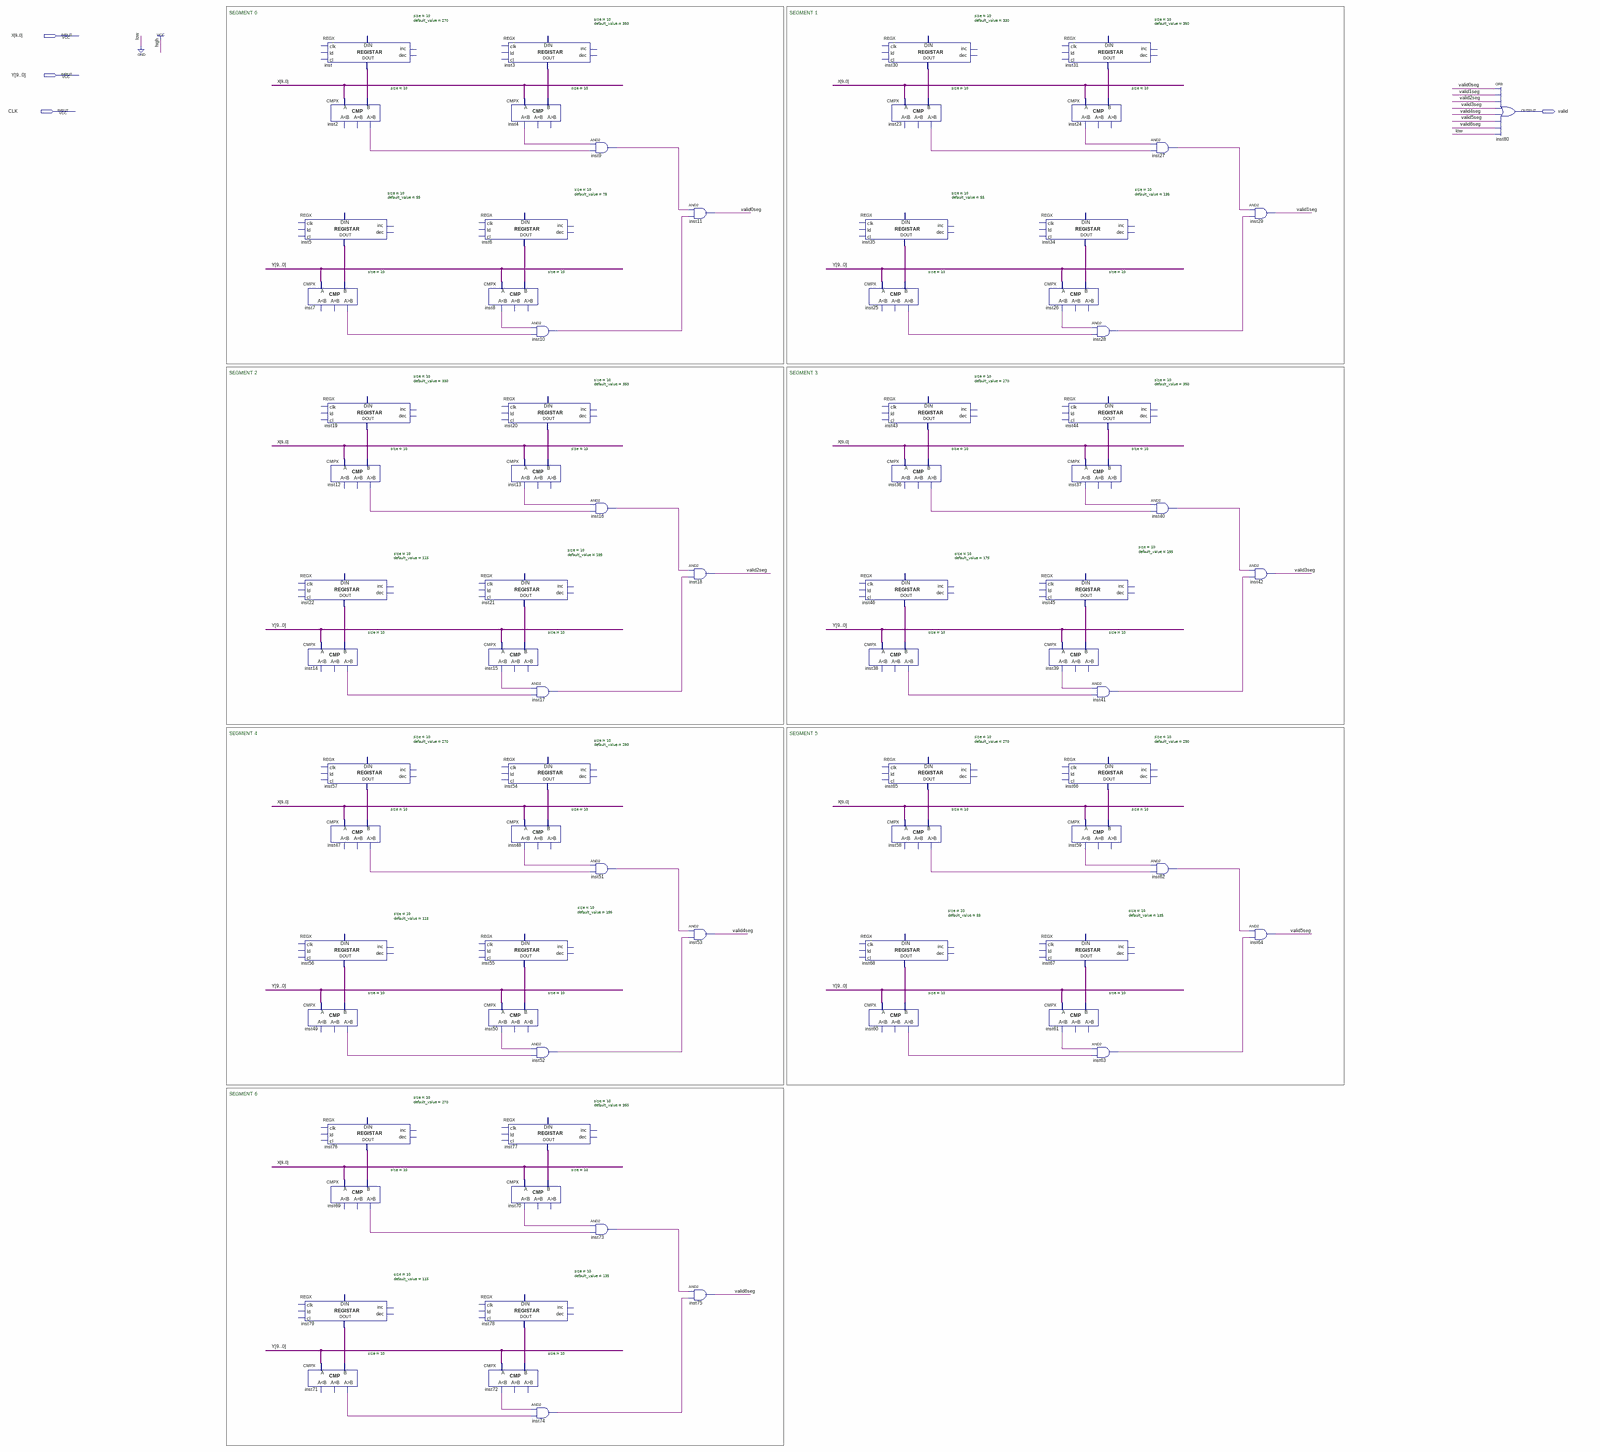
[diagram p0: schematic sheet, whole]
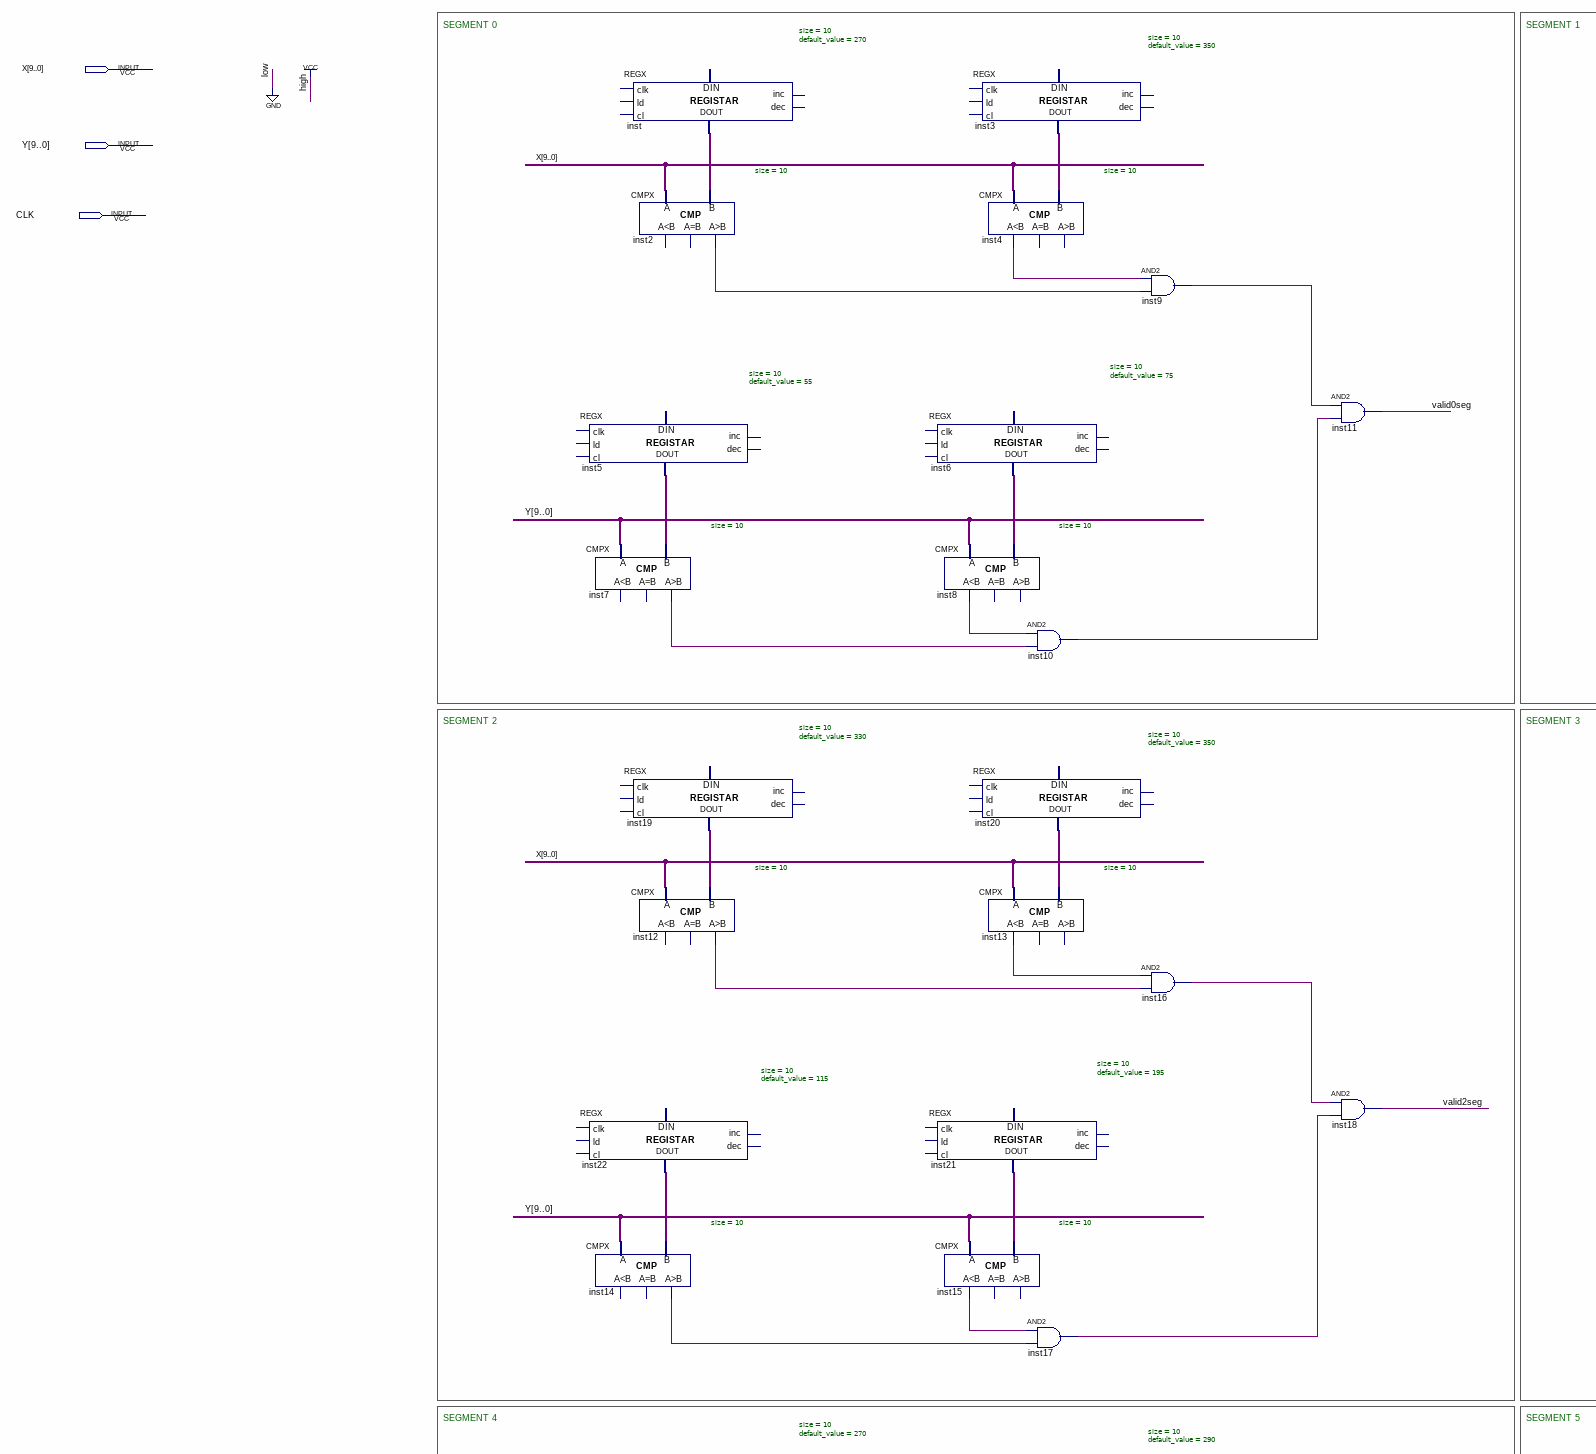
[diagram p1: schematic sheet, upper left part]
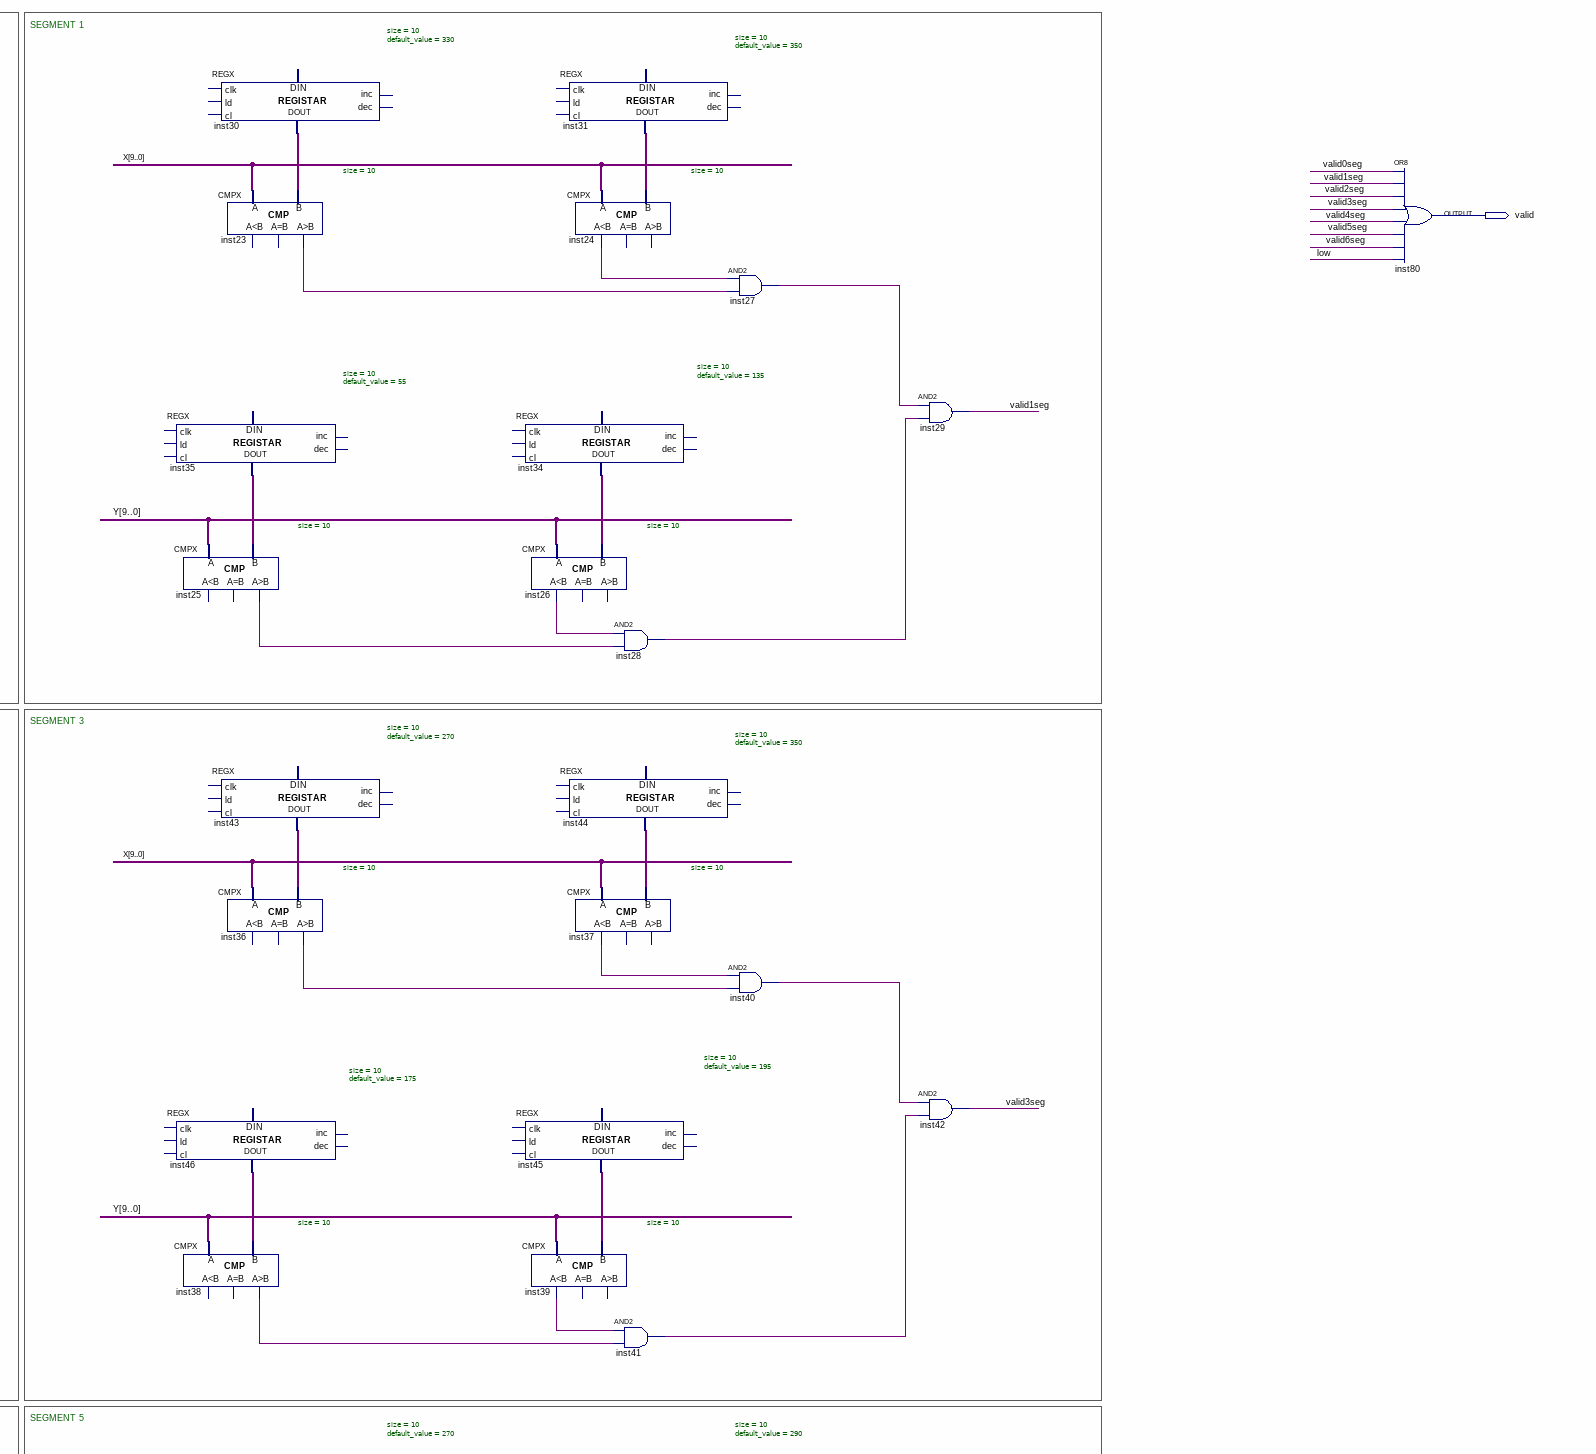
[diagram p2: schematic sheet, upper right part]
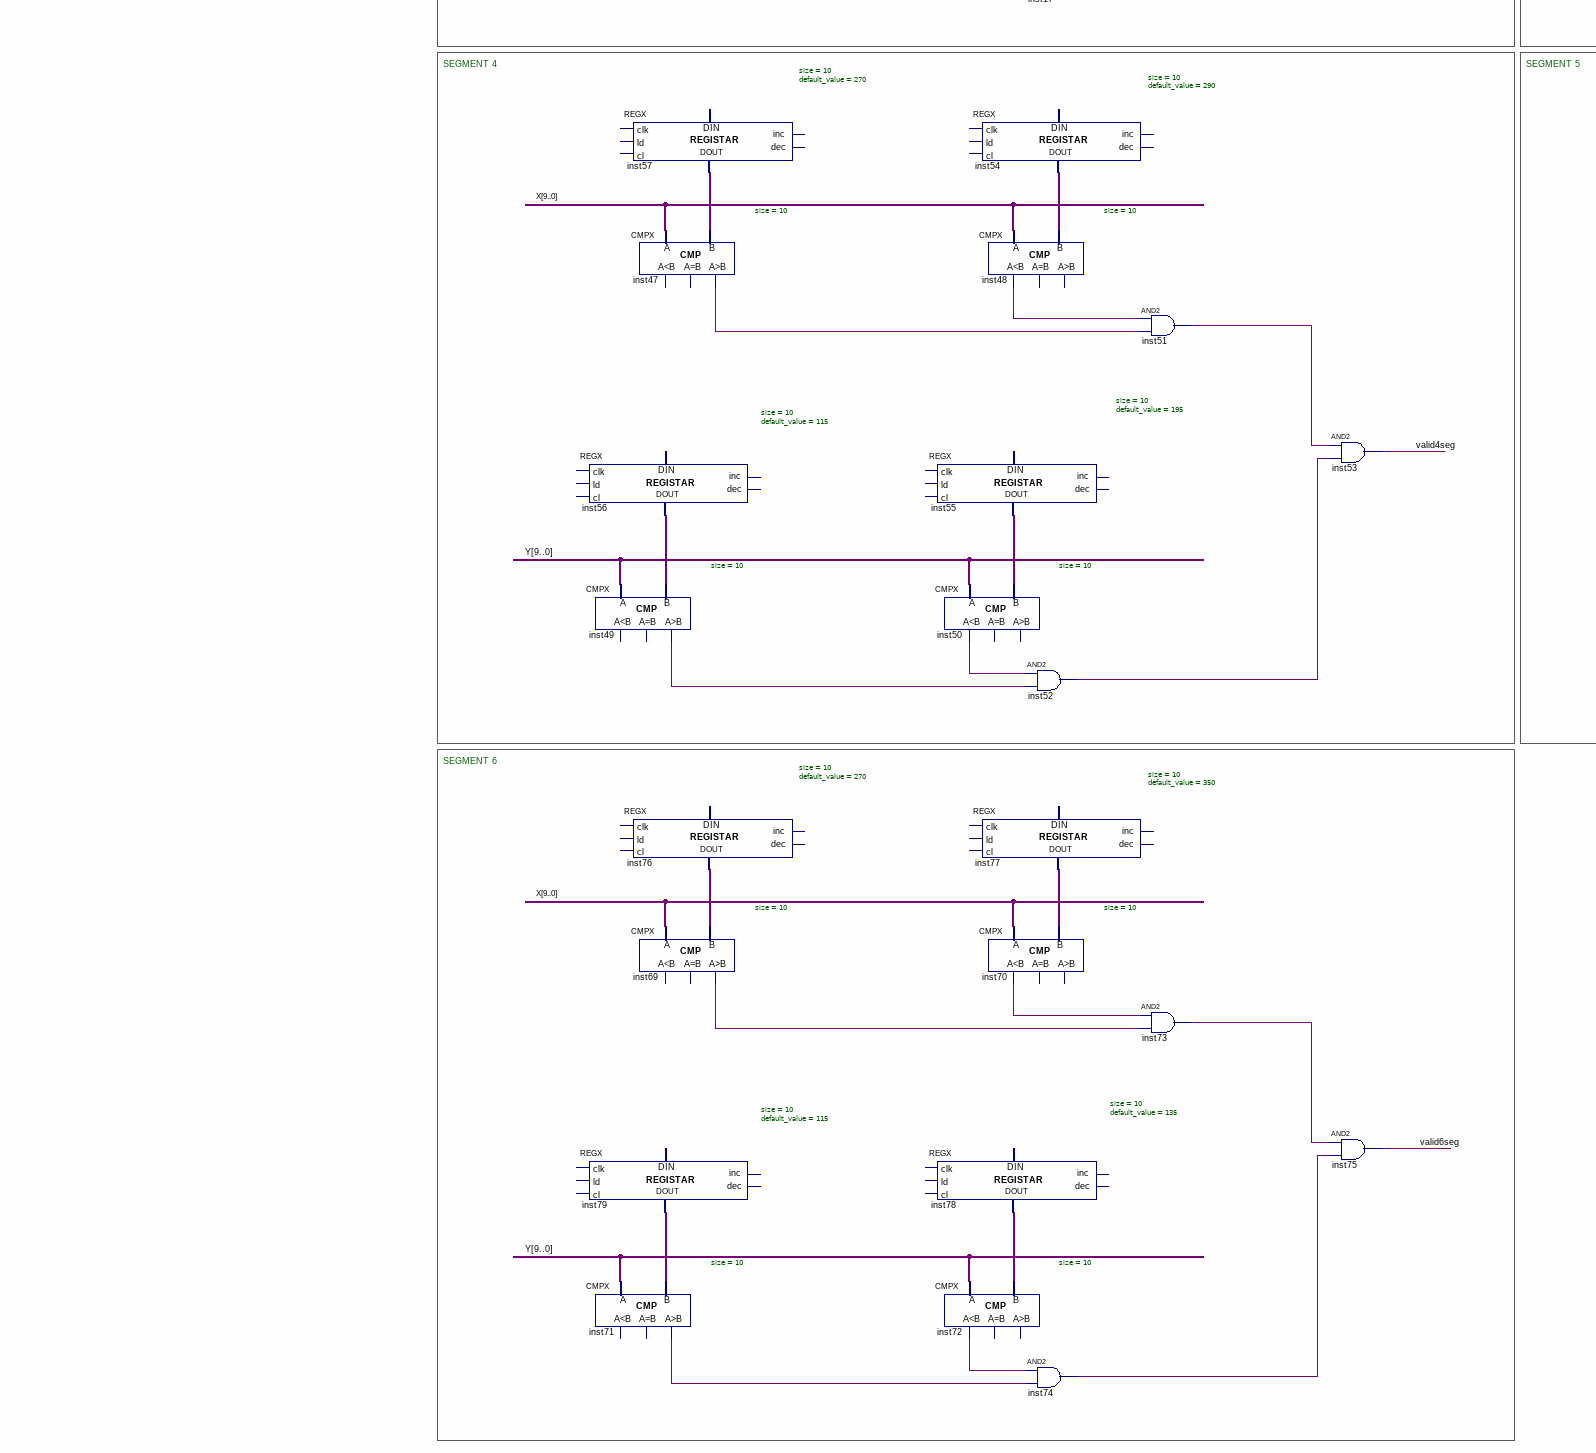
[diagram p3: schematic sheet, lower left part]
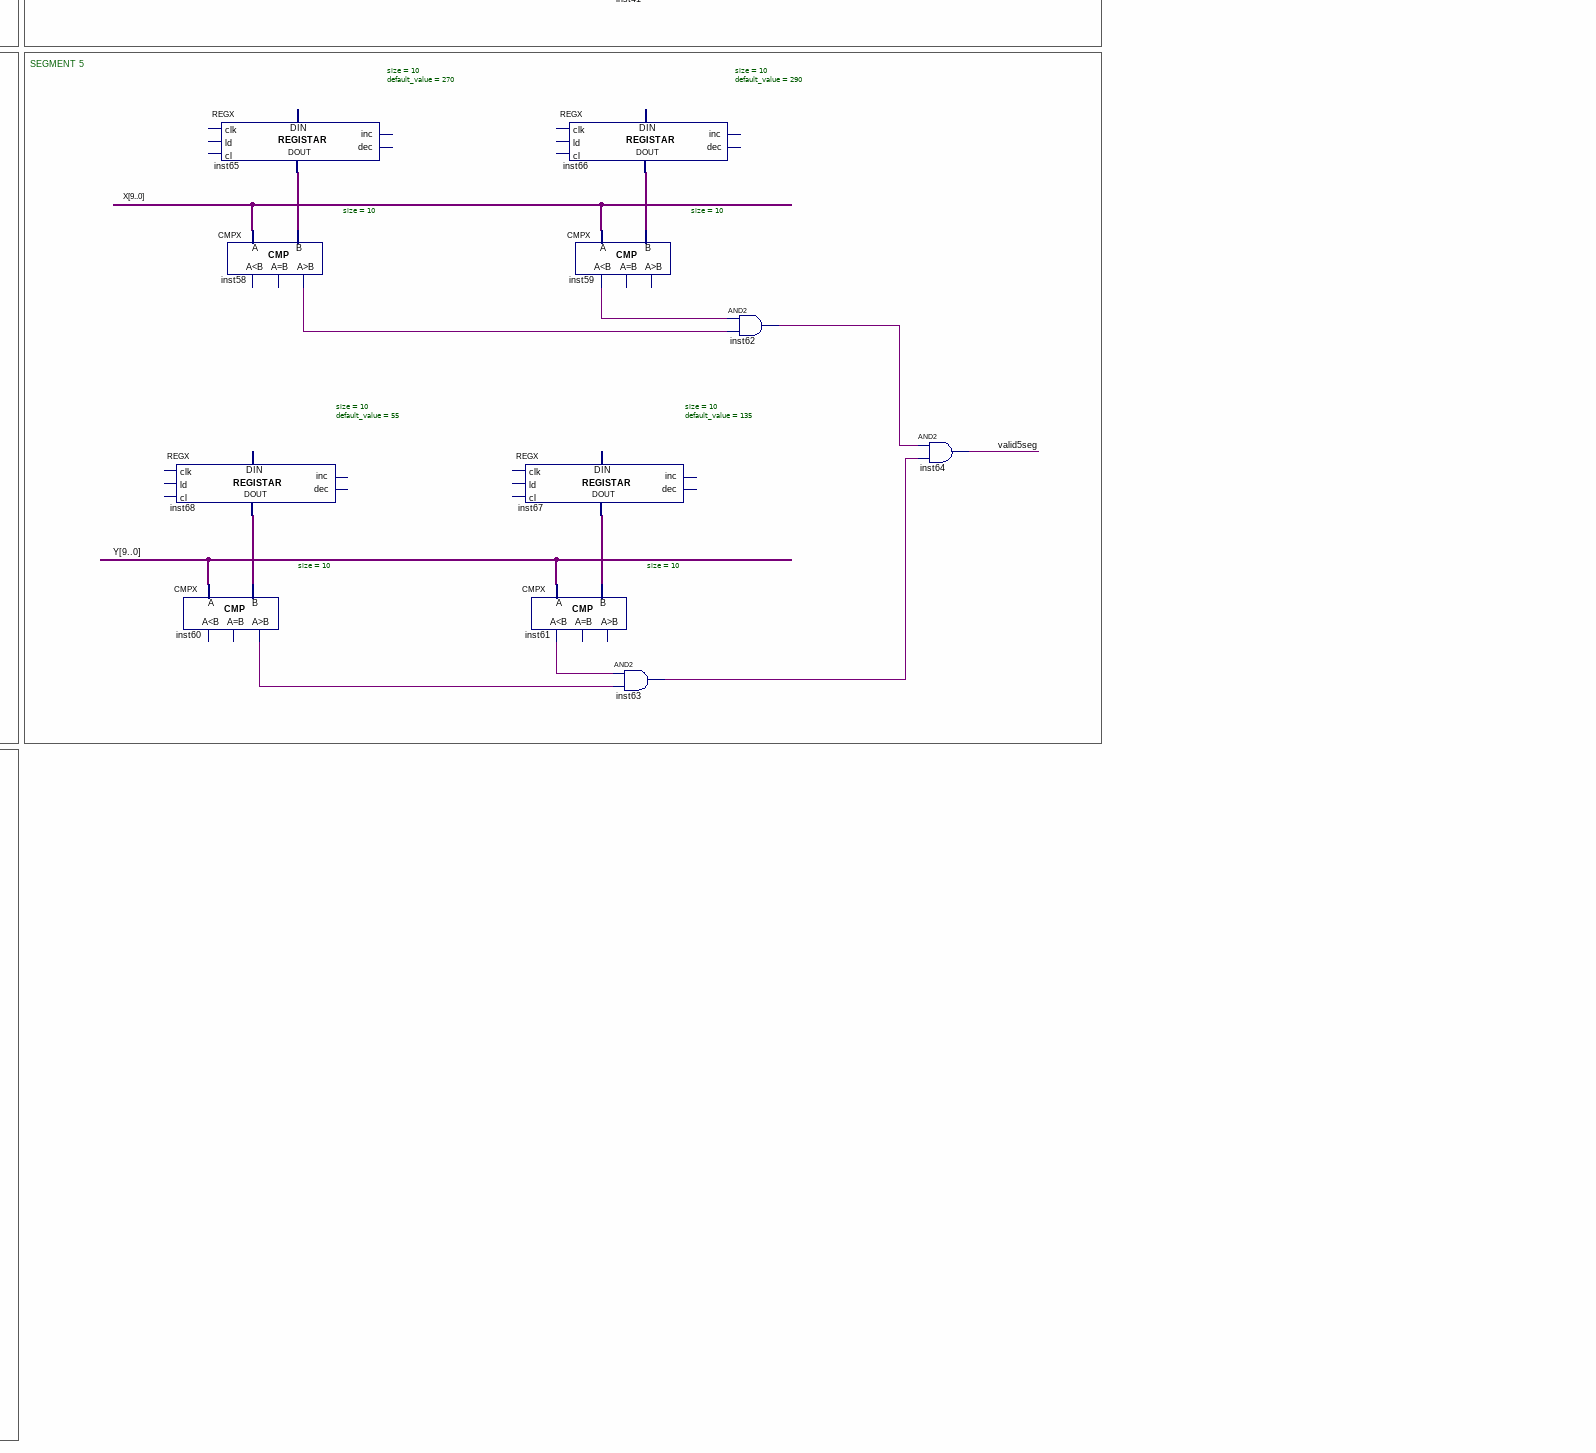
[diagram p4: schematic sheet, lower right part]
// Quartus schematic 7segments.bdf as structural Verilog: 78 symbols, 4 pins
module \7segments  (
  input  [9:0] X,
  input  [9:0] Y,
  input  CLK,
  output valid
);

  wire inst2_gr, inst4_ls, inst7_gr, inst8_ls, inst9_out, inst10_out, inst12_gr, inst13_ls, inst14_gr,
       inst15_ls, inst16_out, inst17_out, inst23_gr, inst24_ls, inst25_gr, inst26_ls, inst27_out, inst28_out,
       inst36_gr, inst37_ls, inst38_gr, inst39_ls, inst40_out, inst41_out, inst47_gr, inst48_ls, inst49_gr,
       inst50_ls, inst51_out, inst52_out, inst58_gr, inst59_ls, inst60_gr, inst61_ls, inst62_out, inst63_out,
       inst69_gr, inst70_ls, inst71_gr, inst72_ls, inst73_out, inst74_out, valid0seg, valid1seg, valid2seg,
       valid3seg, valid4seg, valid5seg, valid6seg;
  wire [9:0] inst3_data_out, inst5_data_out, inst6_data_out, inst19_data_out, inst20_data_out,
       inst21_data_out, inst22_data_out, inst30_data_out, inst31_data_out, inst34_data_out, inst35_data_out,
       inst43_data_out, inst44_data_out, inst45_data_out, inst46_data_out, inst54_data_out, inst55_data_out,
       inst56_data_out, inst57_data_out, inst65_data_out, inst66_data_out, inst67_data_out, inst68_data_out,
       inst76_data_out, inst77_data_out, inst78_data_out, inst79_data_out, inst_data_out;

  REGX #(.size(10), .default_value(270)) inst (.data_out(inst_data_out));  // open: clk, ld, cl, inc, dec, data_in
  REGX #(.size(10), .default_value(55)) inst5 (.data_out(inst5_data_out));  // open: clk, ld, cl, inc, dec, data_in
  CMPX #(.size(10)) inst7 (.A(Y), .B(inst5_data_out), .gr(inst7_gr));  // open: ls, eq
  REGX #(.size(10), .default_value(330)) inst19 (.data_out(inst19_data_out));  // open: clk, ld, cl, inc, dec, data_in
  REGX #(.size(10), .default_value(115)) inst22 (.data_out(inst22_data_out));  // open: clk, ld, cl, inc, dec, data_in
  CMPX #(.size(10)) inst14 (.A(Y), .B(inst22_data_out), .gr(inst14_gr));  // open: ls, eq
  REGX #(.size(10), .default_value(270)) inst57 (.data_out(inst57_data_out));  // open: clk, ld, cl, inc, dec, data_in
  REGX #(.size(10), .default_value(115)) inst56 (.data_out(inst56_data_out));  // open: clk, ld, cl, inc, dec, data_in
  CMPX #(.size(10)) inst49 (.A(Y), .B(inst56_data_out), .gr(inst49_gr));  // open: ls, eq
  REGX #(.size(10), .default_value(270)) inst76 (.data_out(inst76_data_out));  // open: clk, ld, cl, inc, dec, data_in
  REGX #(.size(10), .default_value(115)) inst79 (.data_out(inst79_data_out));  // open: clk, ld, cl, inc, dec, data_in
  CMPX #(.size(10)) inst71 (.A(Y), .B(inst79_data_out), .gr(inst71_gr));  // open: ls, eq
  CMPX #(.size(10)) inst2 (.A(X), .B(inst_data_out), .gr(inst2_gr));  // open: ls, eq
  CMPX #(.size(10)) inst12 (.A(X), .B(inst19_data_out), .gr(inst12_gr));  // open: ls, eq
  CMPX #(.size(10)) inst47 (.A(X), .B(inst57_data_out), .gr(inst47_gr));  // open: ls, eq
  CMPX #(.size(10)) inst69 (.A(X), .B(inst76_data_out), .gr(inst69_gr));  // open: ls, eq
  REGX #(.size(10), .default_value(75)) inst6 (.data_out(inst6_data_out));  // open: clk, ld, cl, inc, dec, data_in
  REGX #(.size(10), .default_value(195)) inst21 (.data_out(inst21_data_out));  // open: clk, ld, cl, inc, dec, data_in
  REGX #(.size(10), .default_value(195)) inst55 (.data_out(inst55_data_out));  // open: clk, ld, cl, inc, dec, data_in
  REGX #(.size(10), .default_value(135)) inst78 (.data_out(inst78_data_out));  // open: clk, ld, cl, inc, dec, data_in
  REGX #(.size(10), .default_value(350)) inst3 (.data_out(inst3_data_out));  // open: clk, ld, cl, inc, dec, data_in
  CMPX #(.size(10)) inst4 (.A(X), .B(inst3_data_out), .ls(inst4_ls));  // open: eq, gr
  CMPX #(.size(10)) inst8 (.A(Y), .B(inst6_data_out), .ls(inst8_ls));  // open: eq, gr
  REGX #(.size(10), .default_value(350)) inst20 (.data_out(inst20_data_out));  // open: clk, ld, cl, inc, dec, data_in
  CMPX #(.size(10)) inst13 (.A(X), .B(inst20_data_out), .ls(inst13_ls));  // open: eq, gr
  CMPX #(.size(10)) inst15 (.A(Y), .B(inst21_data_out), .ls(inst15_ls));  // open: eq, gr
  REGX #(.size(10), .default_value(290)) inst54 (.data_out(inst54_data_out));  // open: clk, ld, cl, inc, dec, data_in
  CMPX #(.size(10)) inst48 (.A(X), .B(inst54_data_out), .ls(inst48_ls));  // open: eq, gr
  CMPX #(.size(10)) inst50 (.A(Y), .B(inst55_data_out), .ls(inst50_ls));  // open: eq, gr
  REGX #(.size(10), .default_value(350)) inst77 (.data_out(inst77_data_out));  // open: clk, ld, cl, inc, dec, data_in
  CMPX #(.size(10)) inst70 (.A(X), .B(inst77_data_out), .ls(inst70_ls));  // open: eq, gr
  CMPX #(.size(10)) inst72 (.A(Y), .B(inst78_data_out), .ls(inst72_ls));  // open: eq, gr
  and inst10 (inst10_out, inst8_ls, inst7_gr);
  and inst17 (inst17_out, inst15_ls, inst14_gr);
  and inst52 (inst52_out, inst50_ls, inst49_gr);
  and inst74 (inst74_out, inst72_ls, inst71_gr);
  and inst9 (inst9_out, inst4_ls, inst2_gr);
  and inst16 (inst16_out, inst13_ls, inst12_gr);
  and inst51 (inst51_out, inst48_ls, inst47_gr);
  and inst73 (inst73_out, inst70_ls, inst69_gr);
  and inst11 (valid0seg, inst9_out, inst10_out);
  and inst18 (valid2seg, inst16_out, inst17_out);
  and inst53 (valid4seg, inst51_out, inst52_out);
  and inst75 (valid6seg, inst73_out, inst74_out);
  REGX #(.size(10), .default_value(55)) inst35 (.data_out(inst35_data_out));  // open: clk, ld, cl, inc, dec, data_in
  CMPX #(.size(10)) inst25 (.A(Y), .B(inst35_data_out), .gr(inst25_gr));  // open: ls, eq
  REGX #(.size(10), .default_value(175)) inst46 (.data_out(inst46_data_out));  // open: clk, ld, cl, inc, dec, data_in
  CMPX #(.size(10)) inst38 (.A(Y), .B(inst46_data_out), .gr(inst38_gr));  // open: ls, eq
  REGX #(.size(10), .default_value(55)) inst68 (.data_out(inst68_data_out));  // open: clk, ld, cl, inc, dec, data_in
  CMPX #(.size(10)) inst60 (.A(Y), .B(inst68_data_out), .gr(inst60_gr));  // open: ls, eq
  REGX #(.size(10), .default_value(330)) inst30 (.data_out(inst30_data_out));  // open: clk, ld, cl, inc, dec, data_in
  CMPX #(.size(10)) inst23 (.A(X), .B(inst30_data_out), .gr(inst23_gr));  // open: ls, eq
  REGX #(.size(10), .default_value(270)) inst43 (.data_out(inst43_data_out));  // open: clk, ld, cl, inc, dec, data_in
  CMPX #(.size(10)) inst36 (.A(X), .B(inst43_data_out), .gr(inst36_gr));  // open: ls, eq
  REGX #(.size(10), .default_value(270)) inst65 (.data_out(inst65_data_out));  // open: clk, ld, cl, inc, dec, data_in
  CMPX #(.size(10)) inst58 (.A(X), .B(inst65_data_out), .gr(inst58_gr));  // open: ls, eq
  REGX #(.size(10), .default_value(135)) inst34 (.data_out(inst34_data_out));  // open: clk, ld, cl, inc, dec, data_in
  CMPX #(.size(10)) inst26 (.A(Y), .B(inst34_data_out), .ls(inst26_ls));  // open: eq, gr
  REGX #(.size(10), .default_value(195)) inst45 (.data_out(inst45_data_out));  // open: clk, ld, cl, inc, dec, data_in
  CMPX #(.size(10)) inst39 (.A(Y), .B(inst45_data_out), .ls(inst39_ls));  // open: eq, gr
  REGX #(.size(10), .default_value(135)) inst67 (.data_out(inst67_data_out));  // open: clk, ld, cl, inc, dec, data_in
  CMPX #(.size(10)) inst61 (.A(Y), .B(inst67_data_out), .ls(inst61_ls));  // open: eq, gr
  REGX #(.size(10), .default_value(350)) inst31 (.data_out(inst31_data_out));  // open: clk, ld, cl, inc, dec, data_in
  CMPX #(.size(10)) inst24 (.A(X), .B(inst31_data_out), .ls(inst24_ls));  // open: eq, gr
  REGX #(.size(10), .default_value(350)) inst44 (.data_out(inst44_data_out));  // open: clk, ld, cl, inc, dec, data_in
  CMPX #(.size(10)) inst37 (.A(X), .B(inst44_data_out), .ls(inst37_ls));  // open: eq, gr
  REGX #(.size(10), .default_value(290)) inst66 (.data_out(inst66_data_out));  // open: clk, ld, cl, inc, dec, data_in
  CMPX #(.size(10)) inst59 (.A(X), .B(inst66_data_out), .ls(inst59_ls));  // open: eq, gr
  and inst28 (inst28_out, inst26_ls, inst25_gr);
  and inst41 (inst41_out, inst39_ls, inst38_gr);
  and inst63 (inst63_out, inst61_ls, inst60_gr);
  and inst27 (inst27_out, inst24_ls, inst23_gr);
  and inst40 (inst40_out, inst37_ls, inst36_gr);
  and inst62 (inst62_out, inst59_ls, inst58_gr);
  and inst29 (valid1seg, inst27_out, inst28_out);
  and inst42 (valid3seg, inst40_out, inst41_out);
  and inst64 (valid5seg, inst62_out, inst63_out);
  or inst80 (valid, valid0seg, valid1seg, valid2seg, valid3seg, valid4seg, valid5seg, valid6seg, 1'b0);

  // Notes on the sheet:
  //   SEGMENT 0
  //   SEGMENT 1
  //   SEGMENT 2
  //   SEGMENT 3
  //   SEGMENT 4
  //   SEGMENT 5
  //   SEGMENT 6
endmodule
